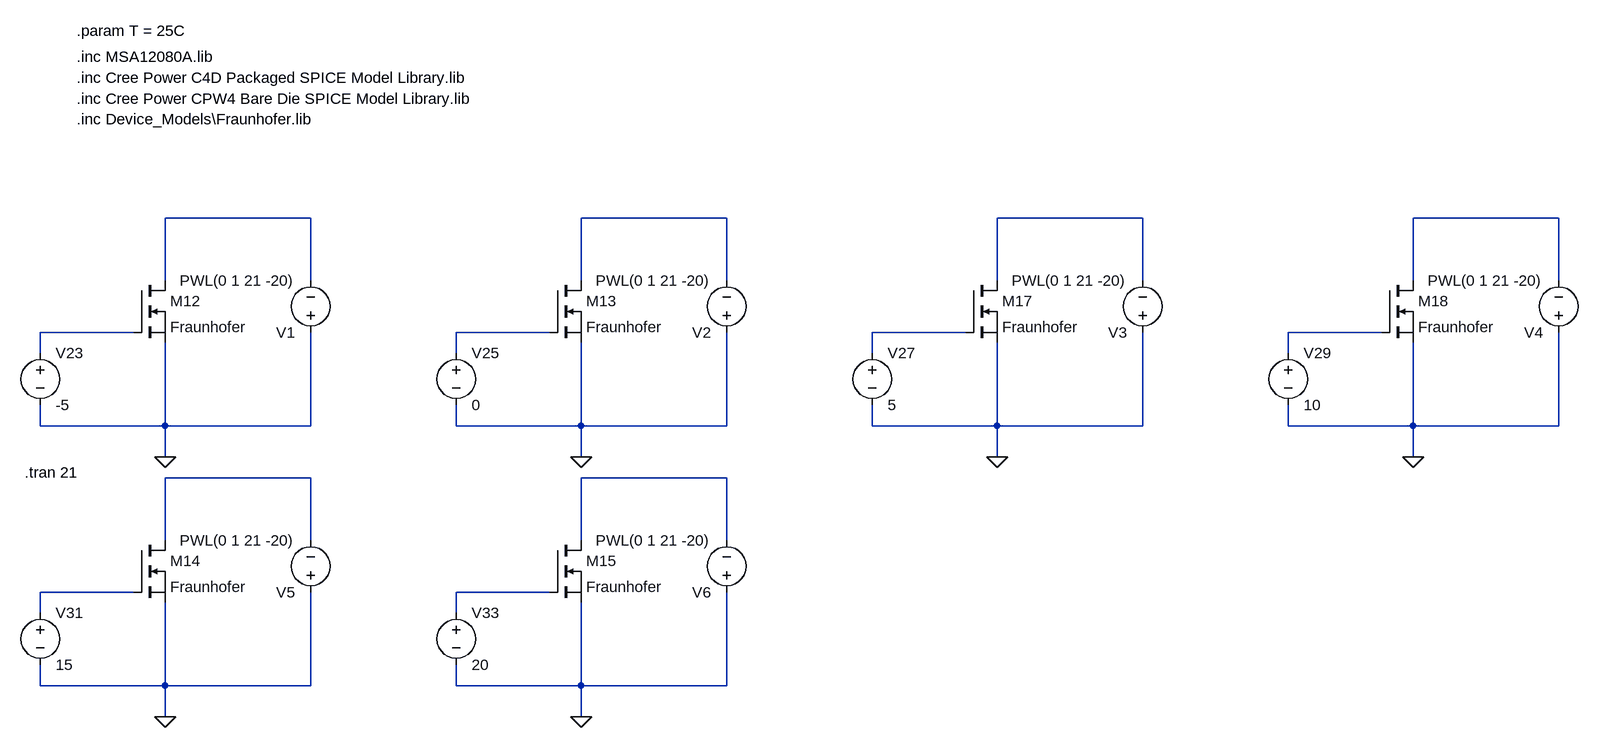
[diagram p0: schematic rev_fwd_curves.asc]
rev_fwd_curves.asc, the LTspice schematic file:
Version 4
SHEET 1 4496 1000
WIRE -352 -224 -576 -224
WIRE 288 -224 64 -224
WIRE 928 -224 704 -224
WIRE 1568 -224 1344 -224
WIRE -576 -128 -576 -224
WIRE -352 -128 -352 -224
WIRE 64 -128 64 -224
WIRE 288 -128 288 -224
WIRE 704 -128 704 -224
WIRE 928 -128 928 -224
WIRE 1344 -128 1344 -224
WIRE 1568 -128 1568 -224
WIRE -624 -48 -768 -48
WIRE 16 -48 -128 -48
WIRE 656 -48 512 -48
WIRE 1296 -48 1152 -48
WIRE -768 -16 -768 -48
WIRE -128 -16 -128 -48
WIRE 512 -16 512 -48
WIRE 1152 -16 1152 -48
WIRE -768 96 -768 64
WIRE -576 96 -576 -32
WIRE -576 96 -768 96
WIRE -352 96 -352 -48
WIRE -352 96 -576 96
WIRE -128 96 -128 64
WIRE 64 96 64 -32
WIRE 64 96 -128 96
WIRE 288 96 288 -48
WIRE 288 96 64 96
WIRE 512 96 512 64
WIRE 704 96 704 -32
WIRE 704 96 512 96
WIRE 928 96 928 -48
WIRE 928 96 704 96
WIRE 1152 96 1152 64
WIRE 1344 96 1344 -32
WIRE 1344 96 1152 96
WIRE 1568 96 1568 -48
WIRE 1568 96 1344 96
WIRE -576 144 -576 96
WIRE 64 144 64 96
WIRE 704 144 704 96
WIRE 1344 144 1344 96
WIRE -352 176 -576 176
WIRE 288 176 64 176
WIRE -576 272 -576 176
WIRE -352 272 -352 176
WIRE 64 272 64 176
WIRE 288 272 288 176
WIRE -624 352 -768 352
WIRE 16 352 -128 352
WIRE -768 384 -768 352
WIRE -128 384 -128 352
WIRE -768 496 -768 464
WIRE -576 496 -576 368
WIRE -576 496 -768 496
WIRE -352 496 -352 352
WIRE -352 496 -576 496
WIRE -128 496 -128 464
WIRE 64 496 64 368
WIRE 64 496 -128 496
WIRE 288 496 288 352
WIRE 288 496 64 496
WIRE -576 544 -576 496
WIRE 64 544 64 496
FLAG -576 144 0
FLAG 64 144 0
FLAG 704 144 0
FLAG 1344 144 0
FLAG -576 544 0
FLAG 64 544 0
SYMBOL nmos -624 -128 R0
SYMATTR InstName M12
SYMATTR Value Fraunhofer
SYMATTR Prefix X
SYMBOL voltage -768 -32 R0
WINDOW 123 0 0 Left 0
WINDOW 39 0 0 Left 0
SYMATTR InstName V23
SYMATTR Value -5
SYMBOL voltage -128 -32 R0
WINDOW 123 0 0 Left 0
WINDOW 39 0 0 Left 0
SYMATTR InstName V25
SYMATTR Value 0
SYMBOL voltage 512 -32 R0
WINDOW 123 0 0 Left 0
WINDOW 39 0 0 Left 0
SYMATTR InstName V27
SYMATTR Value 5
SYMBOL voltage 1152 -32 R0
WINDOW 123 0 0 Left 0
WINDOW 39 0 0 Left 0
SYMATTR InstName V29
SYMATTR Value 10
SYMBOL voltage -768 368 R0
WINDOW 123 0 0 Left 0
WINDOW 39 0 0 Left 0
SYMATTR InstName V31
SYMATTR Value 15
SYMBOL voltage -128 368 R0
WINDOW 123 0 0 Left 0
WINDOW 39 0 0 Left 0
SYMATTR InstName V33
SYMATTR Value 20
SYMBOL nmos 16 -128 R0
SYMATTR InstName M13
SYMATTR Value Fraunhofer
SYMATTR Prefix X
SYMBOL nmos -624 272 R0
SYMATTR InstName M14
SYMATTR Value Fraunhofer
SYMATTR Prefix X
SYMBOL nmos 16 272 R0
SYMATTR InstName M15
SYMATTR Value Fraunhofer
SYMATTR Prefix X
SYMBOL nmos 656 -128 R0
SYMATTR InstName M17
SYMATTR Value Fraunhofer
SYMATTR Prefix X
SYMBOL nmos 1296 -128 R0
SYMATTR InstName M18
SYMATTR Value Fraunhofer
SYMATTR Prefix X
SYMBOL voltage -352 -32 R180
WINDOW 123 0 0 Left 0
WINDOW 39 0 0 Left 0
SYMATTR InstName V1
SYMATTR Value PWL(0 1 21 -20)
SYMBOL voltage 288 -32 R180
WINDOW 123 0 0 Left 0
WINDOW 39 0 0 Left 0
SYMATTR InstName V2
SYMATTR Value PWL(0 1 21 -20)
SYMBOL voltage 928 -32 R180
WINDOW 123 0 0 Left 0
WINDOW 39 0 0 Left 0
SYMATTR InstName V3
SYMATTR Value PWL(0 1 21 -20)
SYMBOL voltage 1568 -32 R180
WINDOW 123 0 0 Left 0
WINDOW 39 0 0 Left 0
SYMATTR InstName V4
SYMATTR Value PWL(0 1 21 -20)
SYMBOL voltage -352 368 R180
WINDOW 123 0 0 Left 0
WINDOW 39 0 0 Left 0
SYMATTR InstName V5
SYMATTR Value PWL(0 1 21 -20)
SYMBOL voltage 288 368 R180
WINDOW 123 0 0 Left 0
WINDOW 39 0 0 Left 0
SYMATTR InstName V6
SYMATTR Value PWL(0 1 21 -20)
TEXT -792 168 Left 2 !.tran 21
TEXT -712 -472 Left 2 !.inc MSA12080A.lib
TEXT -712 -512 Left 2 !.param T = 25C
TEXT -712 -440 Left 2 !.inc Cree Power C4D Packaged SPICE Model Library.lib
TEXT -712 -408 Left 2 !.inc Cree Power CPW4 Bare Die SPICE Model Library.lib
TEXT -712 -376 Left 2 !.inc Device_Models\\Fraunhofer.lib

The netlist it stands for:
* rev_fwd_curves.asc
XM12 N001 N005 0 Fraunhofer  ; pins D G S
V23 N005 0 -5
V25 N006 0 0
V27 N007 0 5
V29 N008 0 10
V31 N011 0 15
V33 N012 0 20
XM13 N002 N006 0 Fraunhofer  ; pins D G S
XM14 N009 N011 0 Fraunhofer  ; pins D G S
XM15 N010 N012 0 Fraunhofer  ; pins D G S
XM17 N003 N007 0 Fraunhofer  ; pins D G S
XM18 N004 N008 0 Fraunhofer  ; pins D G S
V1 0 N001 PWL(0 1 21 -20)
V2 0 N002 PWL(0 1 21 -20)
V3 0 N003 PWL(0 1 21 -20)
V4 0 N004 PWL(0 1 21 -20)
V5 0 N009 PWL(0 1 21 -20)
V6 0 N010 PWL(0 1 21 -20)
.tran 21
.inc MSA12080A.lib
.param T = 25C
.inc Cree Power C4D Packaged SPICE Model Library.lib
.inc Cree Power CPW4 Bare Die SPICE Model Library.lib
.inc Device_Models\Fraunhofer.lib
.backanno
.end